# EAGLE design phase (EAGLE 6.5.0)
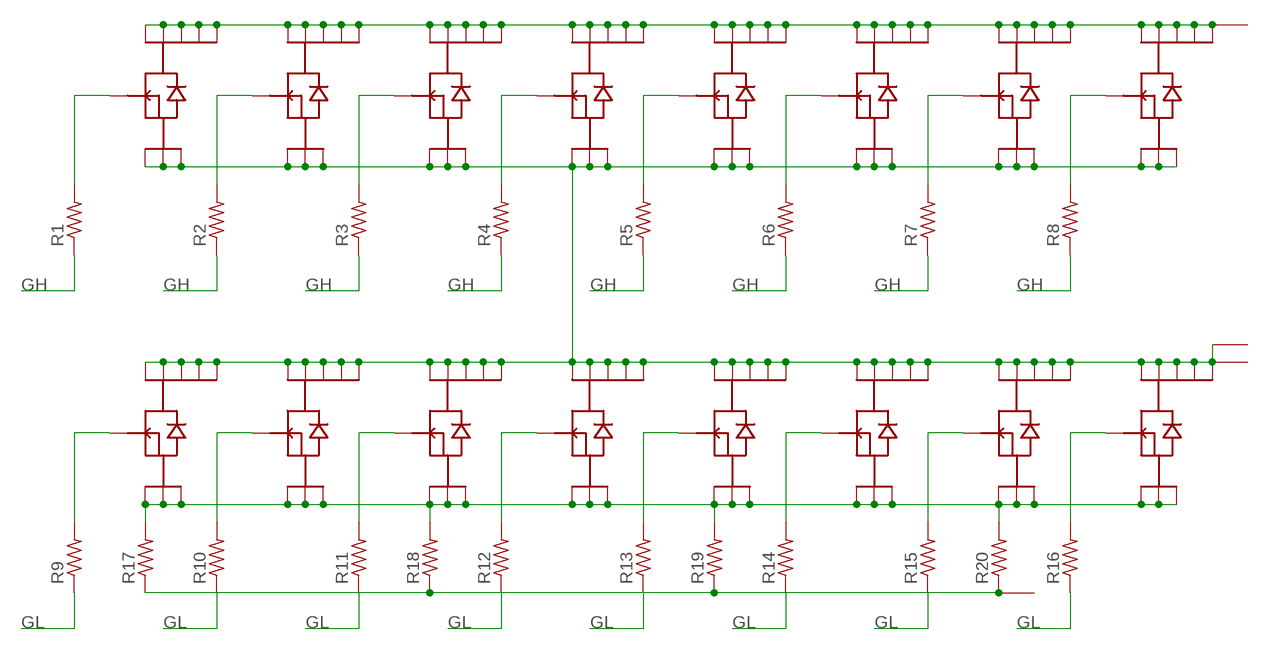
[diagram p0: schematic, sheet 1]

## Parts
R1  R-US_R0603  [R0603]
R2  R-US_R0603  [R0603]
R3  R-US_R0603  [R0603]
R4  R-US_R0603  [R0603]
R5  R-US_R0603  [R0603]
R6  R-US_R0603  [R0603]
R7  R-US_R0603  [R0603]
R8  R-US_R0603  [R0603]
R9  R-US_R0603  [R0603]
R10  R-US_R0603  [R0603]
R11  R-US_R0603  [R0603]
R12  R-US_R0603  [R0603]
R13  R-US_R0603  [R0603]
R14  R-US_R0603  [R0603]
R15  R-US_R0603  [R0603]
R16  R-US_R0603  [R0603]
R17  R-US_M1206  [M1206]
R18  R-US_M1206  [M1206]
R19  R-US_M1206  [M1206]
R20  R-US_M1206  [M1206]
U$1  TPH2R608NH  [SOP-ADVANCE]
U$2  TPH2R608NH  [SOP-ADVANCE]
U$3  TPH2R608NH  [SOP-ADVANCE]
U$4  TPH2R608NH  [SOP-ADVANCE]
U$5  TPH2R608NH  [SOP-ADVANCE]
U$6  TPH2R608NH  [SOP-ADVANCE]
U$7  TPH2R608NH  [SOP-ADVANCE]
U$8  TPH2R608NH  [SOP-ADVANCE]
U$9  TPH2R608NH  [SOP-ADVANCE]
U$10  TPH2R608NH  [SOP-ADVANCE]
U$11  TPH2R608NH  [SOP-ADVANCE]
U$12  TPH2R608NH  [SOP-ADVANCE]
U$13  TPH2R608NH  [SOP-ADVANCE]
U$14  TPH2R608NH  [SOP-ADVANCE]
U$15  TPH2R608NH  [SOP-ADVANCE]
U$16  TPH2R608NH  [SOP-ADVANCE]
U$17  BUSBAR  [BUSBAR]
U$18  BUSBAR  [BUSBAR]
U$19  BUSBAR  [BUSBAR]
U$20  POWERPAD  [POWERPAD]

## Nets
GH: R1.1 R2.1 R3.1 R4.1 R5.1 R6.1 R7.1 R8.1
GL: R9.1 R10.1 R11.1 R12.1 R13.1 R14.1 R15.1 R16.1
N$1: R1.2 U$1.4(G)
N$2: R2.2 U$2.4(G)
N$3: R3.2 U$3.4(G)
N$4: R4.2 U$4.4(G)
N$5: R5.2 U$5.4(G)
N$6: R6.2 U$6.4(G)
N$7: R7.2 U$7.4(G)
N$8: R8.2 U$8.4(G)
N$9: R9.2 U$9.4(G)
N$10: R10.2 U$10.4(G)
N$11: R11.2 U$11.4(G)
N$12: R12.2 U$12.4(G)
N$13: R13.2 U$13.4(G)
N$14: R14.2 U$14.4(G)
N$15: R15.2 U$15.4(G)
N$16: R16.2 U$16.4(G)
N$17: U$1.5(D1) U$1.6(D2) U$1.7(D3) U$1.8(D4) U$1.9(DTAB) U$2.5(D1) U$2.6(D2) U$2.7(D3) U$2.8(D4) U$2.9(DTAB) U$3.5(D1) U$3.6(D2) U$3.7(D3) U$3.8(D4) U$3.9(DTAB) U$4.5(D1) U$4.6(D2) U$4.7(D3) U$4.8(D4) U$4.9(DTAB) U$5.5(D1) U$5.6(D2) U$5.7(D3) U$5.8(D4) U$5.9(DTAB) U$6.5(D1) U$6.6(D2) U$6.7(D3) U$6.8(D4) U$6.9(DTAB) U$7.5(D1) U$7.6(D2) U$7.7(D3) U$7.8(D4) U$7.9(DTAB) U$8.5(D1) U$8.6(D2) U$8.7(D3) U$8.8(D4) U$8.9(DTAB) U$17.P$1
N$18: R17.1 R18.1 R19.1 R20.1 U$19.P$1
N$19: U$1.1(S1) U$1.2(S2) U$1.3(S3) U$2.1(S1) U$2.2(S2) U$2.3(S3) U$3.1(S1) U$3.2(S2) U$3.3(S3) U$4.1(S1) U$4.2(S2) U$4.3(S3) U$5.1(S1) U$5.2(S2) U$5.3(S3) U$6.1(S1) U$6.2(S2) U$6.3(S3) U$7.1(S1) U$7.2(S2) U$7.3(S3) U$8.1(S1) U$8.2(S2) U$8.3(S3) U$9.5(D1) U$9.6(D2) U$9.7(D3) U$9.8(D4) U$9.9(DTAB) U$10.5(D1) U$10.6(D2) U$10.7(D3) U$10.8(D4) U$10.9(DTAB) U$11.5(D1) U$11.6(D2) U$11.7(D3) U$11.8(D4) U$11.9(DTAB) U$12.5(D1) U$12.6(D2) U$12.7(D3) U$12.8(D4) U$12.9(DTAB) U$13.5(D1) U$13.6(D2) U$13.7(D3) U$13.8(D4) U$13.9(DTAB) U$14.5(D1) U$14.6(D2) U$14.7(D3) U$14.8(D4) U$14.9(DTAB) U$15.5(D1) U$15.6(D2) U$15.7(D3) U$15.8(D4) U$15.9(DTAB) U$16.5(D1) U$16.6(D2) U$16.7(D3) U$16.8(D4) U$16.9(DTAB) U$18.P$1 U$20.P$1
N$28: R17.2 R18.2 R19.2 R20.2 U$9.1(S1) U$9.2(S2) U$9.3(S3) U$10.1(S1) U$10.2(S2) U$10.3(S3) U$11.1(S1) U$11.2(S2) U$11.3(S3) U$12.1(S1) U$12.2(S2) U$12.3(S3) U$13.1(S1) U$13.2(S2) U$13.3(S3) U$14.1(S1) U$14.2(S2) U$14.3(S3) U$15.1(S1) U$15.2(S2) U$15.3(S3) U$16.1(S1) U$16.2(S2) U$16.3(S3)

## Library data of the parts
R1-R20 = resistor:R-US_: RESISTOR, American symbol
U$1-U$16 = brushlessrage:TPH2R608NH
U$17-U$19 = brushlessrage:BUSBAR
U$20 = brushlessrage:POWERPAD

## Board
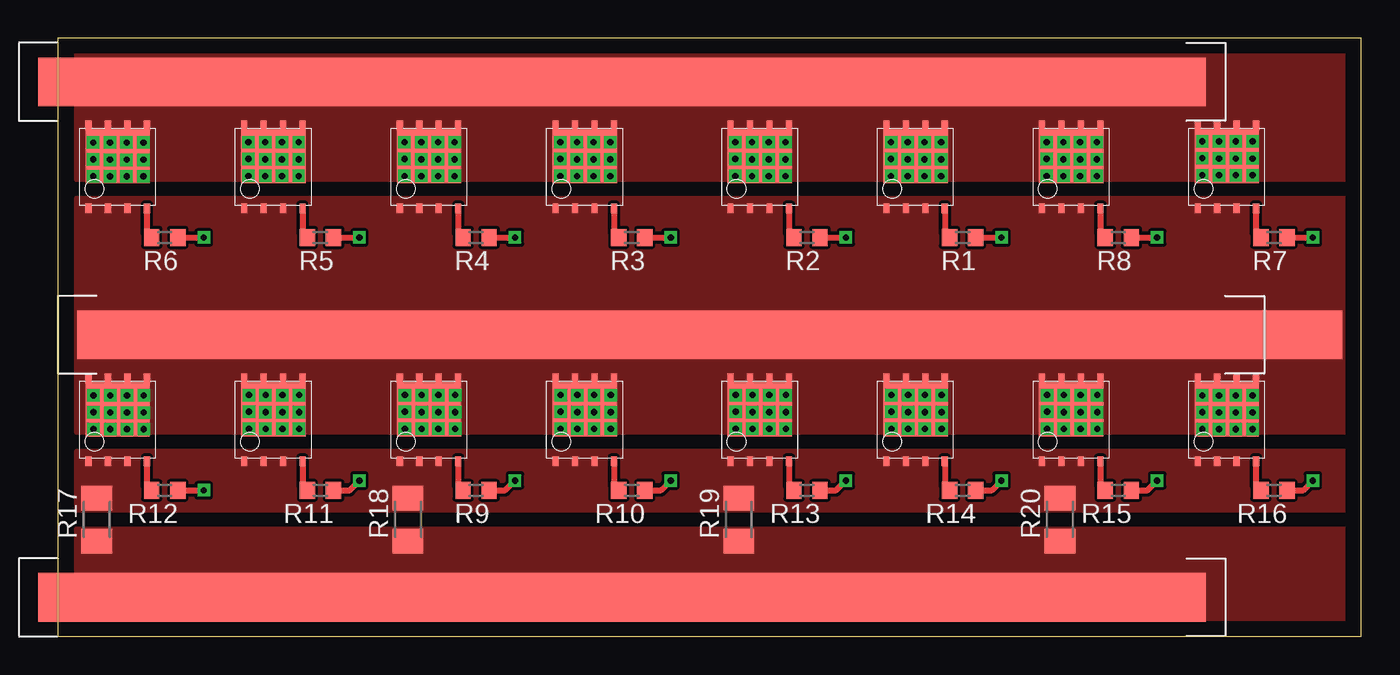
[diagram p1: board, top side]
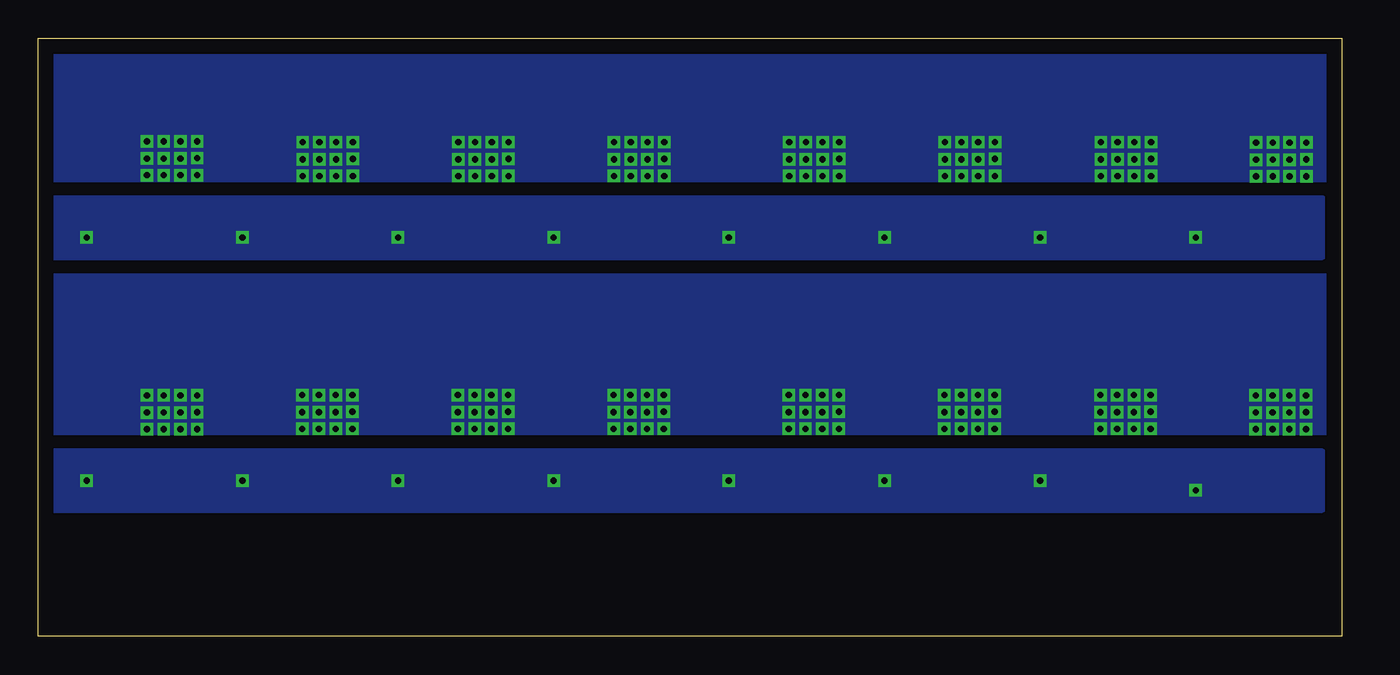
[diagram p2: board, bottom side, seen from below]

Size 85.07 x 39.04 mm. Coordinates in mm from the lower left corner, seen from the top.
Outline: 0,0 85.07,0 85.07,39.04 0,39.04 0,0
Copper layers (1*16): Top 0.035mm / dielectric 1.5mm / Bottom 0.035mm
Design rules "default": minimum track width 10mil, minimum drill 24mil, track to track 8mil, track to pad 8mil, pad to pad 8mil, via to via 8mil, smd to smd 8mil, copper to edge 40mil, drill to drill 8mil, minimum pad ring 10mil, minimum via ring 8mil, stop-mask expansion 4mil, vias tented up to drill 0mil, thermal gap 10mil

### Footprints (pad centres in the part's own frame; a part is rotated, then mirrored left to right if it is on the bottom)
R0603 = smd 1 x 1.1: 1 -0.85,0; 2 0.85,0
M1206 = smd 1.6 x 2: 1 -1.4,0; 2 1.4,0
SOP-ADVANCE = smd 0.4 x 0.6: 1 -1.803,-3.175; 2 -0.533,-3.175; 3 0.737,-3.175; 4 2.007,-3.175; 5 2.007,2.235; 6 0.737,2.235; 7 -0.533,2.235; 8 -1.803,2.235 | smd 4.2 x 3.5: 9 0.102,0.203
BUSBAR = smd 76.2 x 3.175: P$1 0,0
POWERPAD = smd 12.7 x 3.175: P$1 0,0

### Placement (x,y rotation side)
R1  59.05,26.04 180 top
R2  48.9,26.04 180 top
R3  37.47,26.04 180 top
R4  27.3,26.04 180 top
R5  17.14,26.04 180 top
R6  6.98,26.04 180 top
R7  79.38,26.04 180 top
R8  69.21,26.04 180 top
R9  27.3,9.53 180 top
R10  37.47,9.53 180 top
R11  17.14,9.53 180 top
R12  6.98,9.53 180 top
R13  48.9,9.53 180 top
R14  59.05,9.53 180 top
R15  69.21,9.53 180 top
R16  79.38,9.53 180 top
R17  2.54,7.62 90 top
R18  22.86,7.62 90 top
R19  44.45,7.62 90 top
R20  65.41,7.62 90 top
U$1  55.88,31.12 0 top
U$2  45.72,31.12 0 top
U$3  34.29,31.12 0 top
U$4  24.13,31.12 0 top
U$5  13.97,31.12 0 top
U$6  3.81,31.12 0 top
U$7  76.2,31.12 0 top
U$8  66.04,31.12 0 top
U$9  24.13,14.61 0 top
U$10  34.29,14.61 0 top
U$11  13.97,14.61 0 top
U$12  3.81,14.61 0 top
U$13  45.72,14.61 0 top
U$14  55.88,14.61 0 top
U$15  66.04,14.61 0 top
U$16  76.2,14.61 0 top
U$17  36.83,36.2 0 top
U$18  39.37,19.69 0 top
U$19  36.83,2.54 0 top
U$20  77.47,19.69 0 top

### Tracks (layer width: path | path; a pad name or v marks a point on that pad's centre or on a via)
GH  (via drill 0.41 pad 0.61)
  Top 0.406: R6.1 v9.53,26.04 | R5.1 v19.68,26.04 | R4.1 v29.84,26.04 | R3.1 v40.01,26.04 | R2.1 v51.44,26.04 | R1.1 v61.6,26.04 | R8.1 v71.75,26.04 | R7.1 v81.91,26.04
  pour Bottom: 1.27,28.58 85.09,28.58 85.09,24.77 1.27,24.77
GL  (via drill 0.41 pad 0.61)
  Top 0.406: R12.1 v9.53,9.53 | R11.1 19.05,9.53 v19.68,10.16 | R9.1 29.21,9.53 v29.84,10.16 | R10.1 39.37,9.53 v40.01,10.16 | R13.1 50.8,9.53 v51.44,10.16 | R14.1 60.96,9.53 v61.6,10.16 | R15.1 71.12,9.53 v71.75,10.16 | R16.1 81.28,9.53 v81.91,10.16
  pour Bottom: 1.27,12.06 85.09,12.06 85.09,8.25 1.27,8.25
N$1
  Top 0.406: U$1.4 57.89,26.35 R1.2
N$2
  Top 0.406: U$2.4 47.73,26.35 R2.2
N$3
  Top 0.406: U$3.4 36.3,26.35 R3.2
N$4
  Top 0.406: U$4.4 26.14,26.35 R4.2
N$5
  Top 0.406: U$5.4 15.98,26.35 R5.2
N$6
  Top 0.406: U$6.4 5.82,26.35 R6.2
N$7
  Top 0.406: U$7.4 78.21,26.35 R7.2
N$8
  Top 0.406: U$8.4 68.05,26.35 R8.2
N$9
  Top 0.406: U$9.4 26.14,9.84 R9.2
N$10
  Top 0.406: U$10.4 36.3,9.84 R10.2
N$11
  Top 0.406: U$11.4 15.98,9.84 R11.2
N$12
  Top 0.406: U$12.4 5.82,9.84 R12.2
N$13
  Top 0.406: U$13.4 47.73,9.84 R13.2
N$14
  Top 0.406: U$14.4 57.89,9.84 R14.2
N$15
  Top 0.406: U$15.4 68.05,9.84 R15.2
N$16
  Top 0.406: U$16.4 78.21,9.84 R16.2
N$17  (via drill 0.41)
  other vias: 2.31,32.23 3.4,32.23 4.5,32.23 4.5,31.12 3.4,31.12 2.31,31.14 5.59,32.23 5.59,31.12 5.59,30.02 4.5,30.02 3.4,30.02 2.31,30.02 12.45,32.26 13.54,32.26 14.63,32.26 14.63,31.14 13.54,31.14 12.45,31.17 15.72,32.26 15.72,31.14 15.72,30.05 14.63,30.05 13.54,30.05 12.45,30.05 22.63,32.26 23.72,32.26 24.82,32.26 24.82,31.14 23.72,31.14 22.63,31.17 25.91,32.26 25.91,31.14 25.91,30.05 24.82,30.05 23.72,30.05 22.63,30.05 32.79,32.26 33.88,32.26 34.98,32.26 34.98,31.14 33.88,31.14 32.79,31.17 36.07,32.26 36.07,31.14 36.07,30.05 34.98,30.05 33.88,30.05 32.79,30.05 44.22,32.26 45.31,32.26 46.41,32.26 46.41,31.14 45.31,31.14 44.22,31.17 47.5,32.26 47.5,31.14 47.5,30.05 46.41,30.05 45.31,30.05 44.22,30.05 54.38,32.26 55.47,32.26 56.57,32.26 56.57,31.14 55.47,31.14 54.38,31.17 57.66,32.26 57.66,31.14 57.66,30.05 56.57,30.05 55.47,30.05 54.38,30.05 64.54,32.26 65.63,32.26 66.73,32.26 66.73,31.14 65.63,31.14 64.54,31.17 67.82,32.26 67.82,31.14 67.82,30.05 66.73,30.05 65.63,30.05 64.54,30.05 74.7,32.31 75.79,32.31 76.89,32.31 76.89,31.19 75.79,31.19 74.7,31.22 77.98,32.31 77.98,31.19 77.98,30.1 76.89,30.1 75.79,30.1 74.7,30.1
  pour Top (no thermals): 1.27,39.37 85.09,39.37 85.09,29.84 1.27,29.84
  pour Bottom: 0,39.37 85.09,39.37 85.09,29.84 0,29.84
N$18
  pour Top (no thermals): 1.27,6.98 85.09,6.98 85.09,0 1.27,0
N$19  (via drill 0.41)
  other vias: 2.34,15.72 3.43,15.72 4.52,15.72 4.52,14.61 3.43,14.61 2.34,14.63 5.61,15.72 5.61,14.61 5.61,13.51 4.52,13.51 3.43,13.51 2.34,13.51 12.47,15.75 13.56,15.75 14.66,15.75 14.66,14.63 13.56,14.63 12.47,14.66 15.75,15.75 15.75,14.63 15.75,13.54 14.66,13.54 13.56,13.54 12.47,13.54 22.66,15.75 23.75,15.75 24.84,15.75 24.84,14.63 23.75,14.63 22.66,14.66 25.93,15.75 25.93,14.63 25.93,13.54 24.84,13.54 23.75,13.54 22.66,13.54 32.82,15.75 33.91,15.75 35,15.75 35,14.63 33.91,14.63 32.82,14.66 36.09,15.75 36.09,14.63 36.09,13.54 35,13.54 33.91,13.54 32.82,13.54 44.25,15.75 45.34,15.75 46.43,15.75 46.43,14.63 45.34,14.63 44.25,14.66 47.52,15.75 47.52,14.63 47.52,13.54 46.43,13.54 45.34,13.54 44.25,13.54 54.41,15.75 55.5,15.75 56.59,15.75 56.59,14.63 55.5,14.63 54.41,14.66 57.68,15.75 57.68,14.63 57.68,13.54 56.59,13.54 55.5,13.54 54.41,13.54 64.57,15.75 65.66,15.75 66.75,15.75 66.75,14.63 65.66,14.63 64.57,14.66 67.84,15.75 67.84,14.63 67.84,13.54 66.75,13.54 65.66,13.54 64.57,13.54 74.7,15.72 75.79,15.72 76.89,15.72 76.89,14.61 75.79,14.61 74.7,14.63 77.98,15.72 77.98,14.61 77.98,13.51 76.89,13.51 75.79,13.51 74.7,13.51
  pour Top (no thermals): 1.27,28.58 85.09,28.58 85.09,13.34 1.27,13.34
  pour Bottom: 0,23.49 85.09,23.49 85.09,13.34 0,13.34
N$28
  pour Top (no thermals): 1.27,12.06 85.09,12.06 85.09,8.25 1.27,8.25